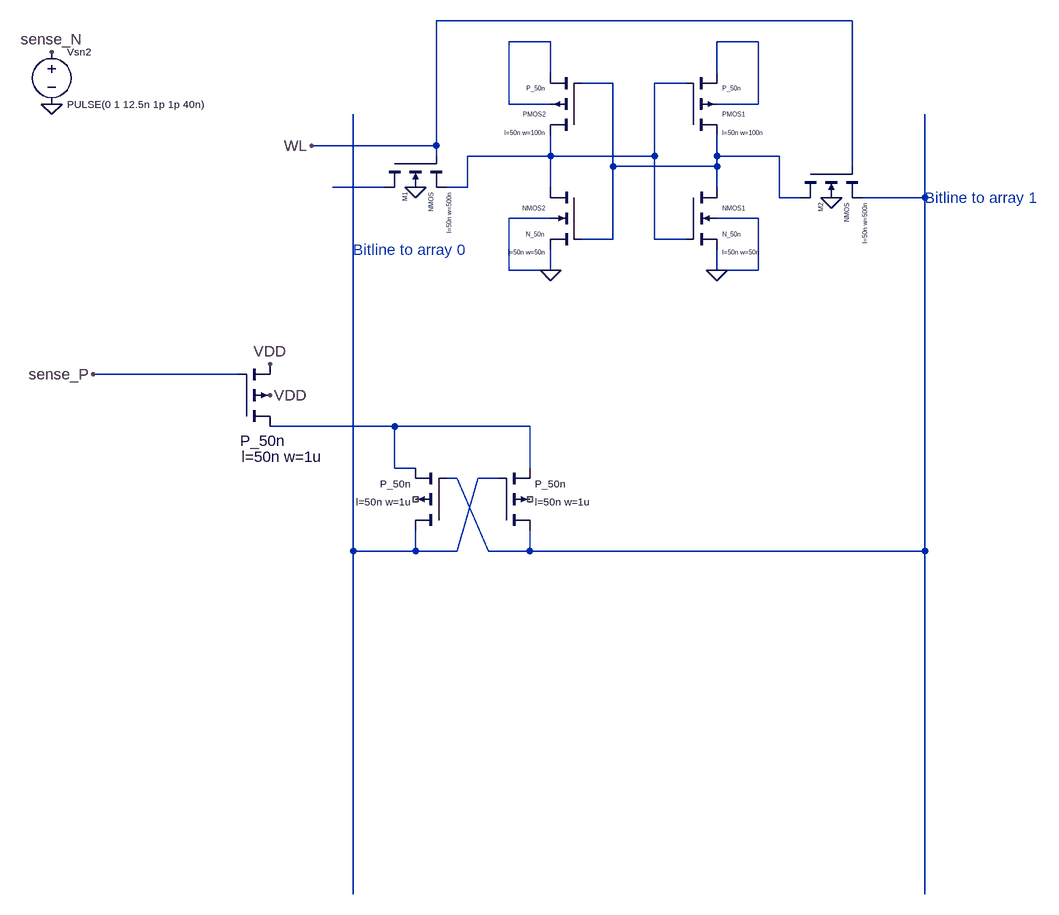
[diagram p0: schematic 8DRAM.asc]
8DRAM.asc, the LTspice schematic file:
Version 4
SHEET 1 1064 1204
WIRE 752 -144 112 -144
WIRE 288 -112 224 -112
WIRE 608 -112 544 -112
WIRE 288 -64 288 -112
WIRE 544 -64 544 -112
WIRE 384 -48 336 -48
WIRE 496 -48 448 -48
WIRE 224 -16 224 -112
WIRE 288 -16 224 -16
WIRE 608 -16 608 -112
WIRE 608 -16 544 -16
WIRE 112 48 112 -144
WIRE 112 48 -80 48
WIRE 112 64 112 48
WIRE 288 64 288 32
WIRE 288 64 160 64
WIRE 448 64 448 -48
WIRE 448 64 288 64
WIRE 544 64 544 32
WIRE 640 64 544 64
WIRE 384 80 384 -48
WIRE 544 80 544 64
WIRE 544 80 384 80
WIRE 752 80 752 -144
WIRE 32 112 -48 112
WIRE 160 112 160 64
WIRE 160 112 128 112
WIRE 288 112 288 64
WIRE 544 112 544 80
WIRE 640 128 640 64
WIRE 672 128 640 128
WIRE 864 128 864 0
WIRE 864 128 768 128
WIRE 288 160 224 160
WIRE 608 160 544 160
WIRE 384 192 384 80
WIRE 384 192 336 192
WIRE 448 192 448 64
WIRE 496 192 448 192
WIRE 224 240 224 160
WIRE 288 240 288 208
WIRE 288 240 224 240
WIRE 544 240 544 208
WIRE 608 240 608 160
WIRE 608 240 544 240
WIRE -192 400 -416 400
WIRE 48 480 -144 480
WIRE 256 480 48 480
WIRE 48 544 48 480
WIRE 80 544 48 544
WIRE 256 544 256 480
WIRE 144 560 128 560
WIRE 208 560 176 560
WIRE -16 672 -16 0
WIRE 80 672 80 640
WIRE 80 672 -16 672
WIRE 144 672 176 560
WIRE 144 672 80 672
WIRE 192 672 144 560
WIRE 256 672 256 640
WIRE 256 672 192 672
WIRE 864 672 864 128
WIRE 864 672 256 672
WIRE -16 1200 -16 672
WIRE 864 1200 864 672
FLAG 288 240 0
FLAG 544 240 0
FLAG 720 128 0
FLAG 80 112 0
FLAG -480 -96 sense_N
FLAG -480 -16 0
FLAG -80 48 WL
FLAG -144 432 VDD
FLAG -144 384 VDD
FLAG -416 400 sense_P
SYMBOL nmos4 32 64 M90
WINDOW 0 56 32 Left 0
WINDOW 3 56 72 Left 0
WINDOW 123 56 100 Left 0
SYMATTR InstName M1
SYMATTR Value2 l=50n w=500n
SYMBOL nmos4 672 80 M90
WINDOW 0 56 32 Left 0
WINDOW 3 56 72 Left 0
WINDOW 123 56 100 Left 0
SYMATTR InstName M2
SYMATTR Value2 l=50n w=500n
SYMBOL nmos4 336 112 M0
WINDOW 0 56 32 Left 0
WINDOW 3 56 72 Left 0
WINDOW 123 56 100 Left 0
SYMATTR InstName NMOS2
SYMATTR Value N_50n
SYMATTR Value2 l=50n w=50n
SYMBOL nmos4 496 112 R0
WINDOW 0 56 32 Left 0
WINDOW 3 56 72 Left 0
WINDOW 123 56 100 Left 0
SYMATTR InstName NMOS1
SYMATTR Value N_50n
SYMATTR Value2 l=50n w=50n
SYMBOL pmos4 336 32 R180
WINDOW 0 56 32 Left 0
WINDOW 3 56 72 Left 0
WINDOW 123 56 4 Left 0
SYMATTR InstName PMOS2
SYMATTR Value P_50n
SYMATTR Value2 l=50n w=100n
SYMBOL pmos4 496 32 M180
WINDOW 0 56 32 Left 0
WINDOW 3 56 72 Left 0
WINDOW 123 56 4 Left 0
SYMATTR InstName PMOS1
SYMATTR Value P_50n
SYMATTR Value2 l=50n w=100n
SYMBOL voltage -480 -112 R0
WINDOW 0 24 16 Left 1
WINDOW 3 24 96 Left 1
WINDOW 123 0 0 Left 0
WINDOW 39 0 0 Left 0
SYMATTR InstName Vsn2
SYMATTR Value PULSE(0 1 12.5n 1p 1p 40n)
SYMBOL pmos4 128 640 R180
WINDOW 0 56 32 Invisible 0
WINDOW 3 56 72 Left 1
WINDOW 123 56 44 Left 1
SYMATTR InstName PMOS
SYMATTR Value P_50n
SYMATTR Value2 l=50n w=1u
SYMBOL pmos4 208 640 M180
WINDOW 0 56 32 Invisible 0
WINDOW 3 56 72 Left 1
WINDOW 123 56 44 Left 1
SYMATTR InstName PMOS
SYMATTR Value P_50n
SYMATTR Value2 l=50n w=1u
SYMBOL pmos4 -192 480 M180
WINDOW 0 2 -22 Left 2
WINDOW 3 56 72 Invisible 2
WINDOW 123 4 -47 Left 2
SYMATTR InstName P_50n
SYMATTR Value2 l=50n w=1u
TEXT 864 128 Left 2 ;Bitline to array 1
TEXT -16 208 Left 2 ;Bitline to array 0

The netlist it stands for:
* 8DRAM.asc
M1 N005 WL N004 0 NMOS l=50n w=500n
M2 N003 WL N006 0 NMOS l=50n w=500n
M§NMOS2 N004 N003 0 0 N_50n l=50n w=50n
M§NMOS1 N003 N004 0 0 N_50n l=50n w=50n
M§PMOS2 N004 N003 N001 N001 P_50n l=50n w=100n
M§PMOS1 N003 N004 N002 N002 P_50n l=50n w=100n
Vsn2 sense_N 0 PULSE(0 1 12.5n 1p 1p 40n)
M§PMOS N008 N006 N007 NC_01 P_50n l=50n w=1u
M§PMOS N006 N008 N007 NC_02 P_50n l=50n w=1u
M§P_50n N007 sense_P VDD VDD PMOS l=50n w=1u
.model NMOS NMOS
.model PMOS PMOS
.lib standard.mos
* Bitline to array 1
* Bitline to array 0
.backanno
.end